# Altium schematic sheet Analog Circuits.SchDoc: Analog Circuits
size B; DrawnBy: Jasper Yun; SheetNumber: 4; SheetTotal: 4; Competition: SAC 2021; Subteam: Avionics; University: McGill University; Location: Montreal, Quebec; Project: Avionics Project Name; MRT: McGill Rocket Team
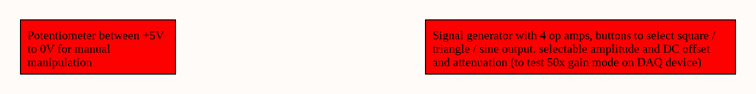
[diagram p0: Analog Circuits.SchDoc]

## Notes on the sheet
- Potentiometer between +5V to 0V for manual manipulation
- Signal generator with 4 op amps, buttons to select square / triangle / sine output. selectable amplitude and DC offset and attenuation (to test 50x gain mode on DAQ device)
- Title
- Size:
- Date:
- B
- Revision:
- Time:
- Drawn By:
- Sheet
- of
- File: